# Altium schematic sheet 08 B2B.SchDoc
size A2; VersionControl_RevNumber: DNP; IsUserConfigurable: DNP; OrgAddr3: Sunrise FL 33323; OrgName: Pixels on Target; Page Create Date: March  8, 1995; Page Number: 5; Page Size: A2; Page Count: 14; OrgAddr2: Suite #104; RevCode: A; Doc: SCH30-00070-00; DsnPath: C:\Users\Carter Nichols\Documents\BitBucket boards (Cadence)\30-00070-00_Original\SCH30-00070-00.DSN; SchematicName: SC30-00070-00; PageName: 05-POWER IN; PageSize: A2; TopSchematic: True; Address4: United States
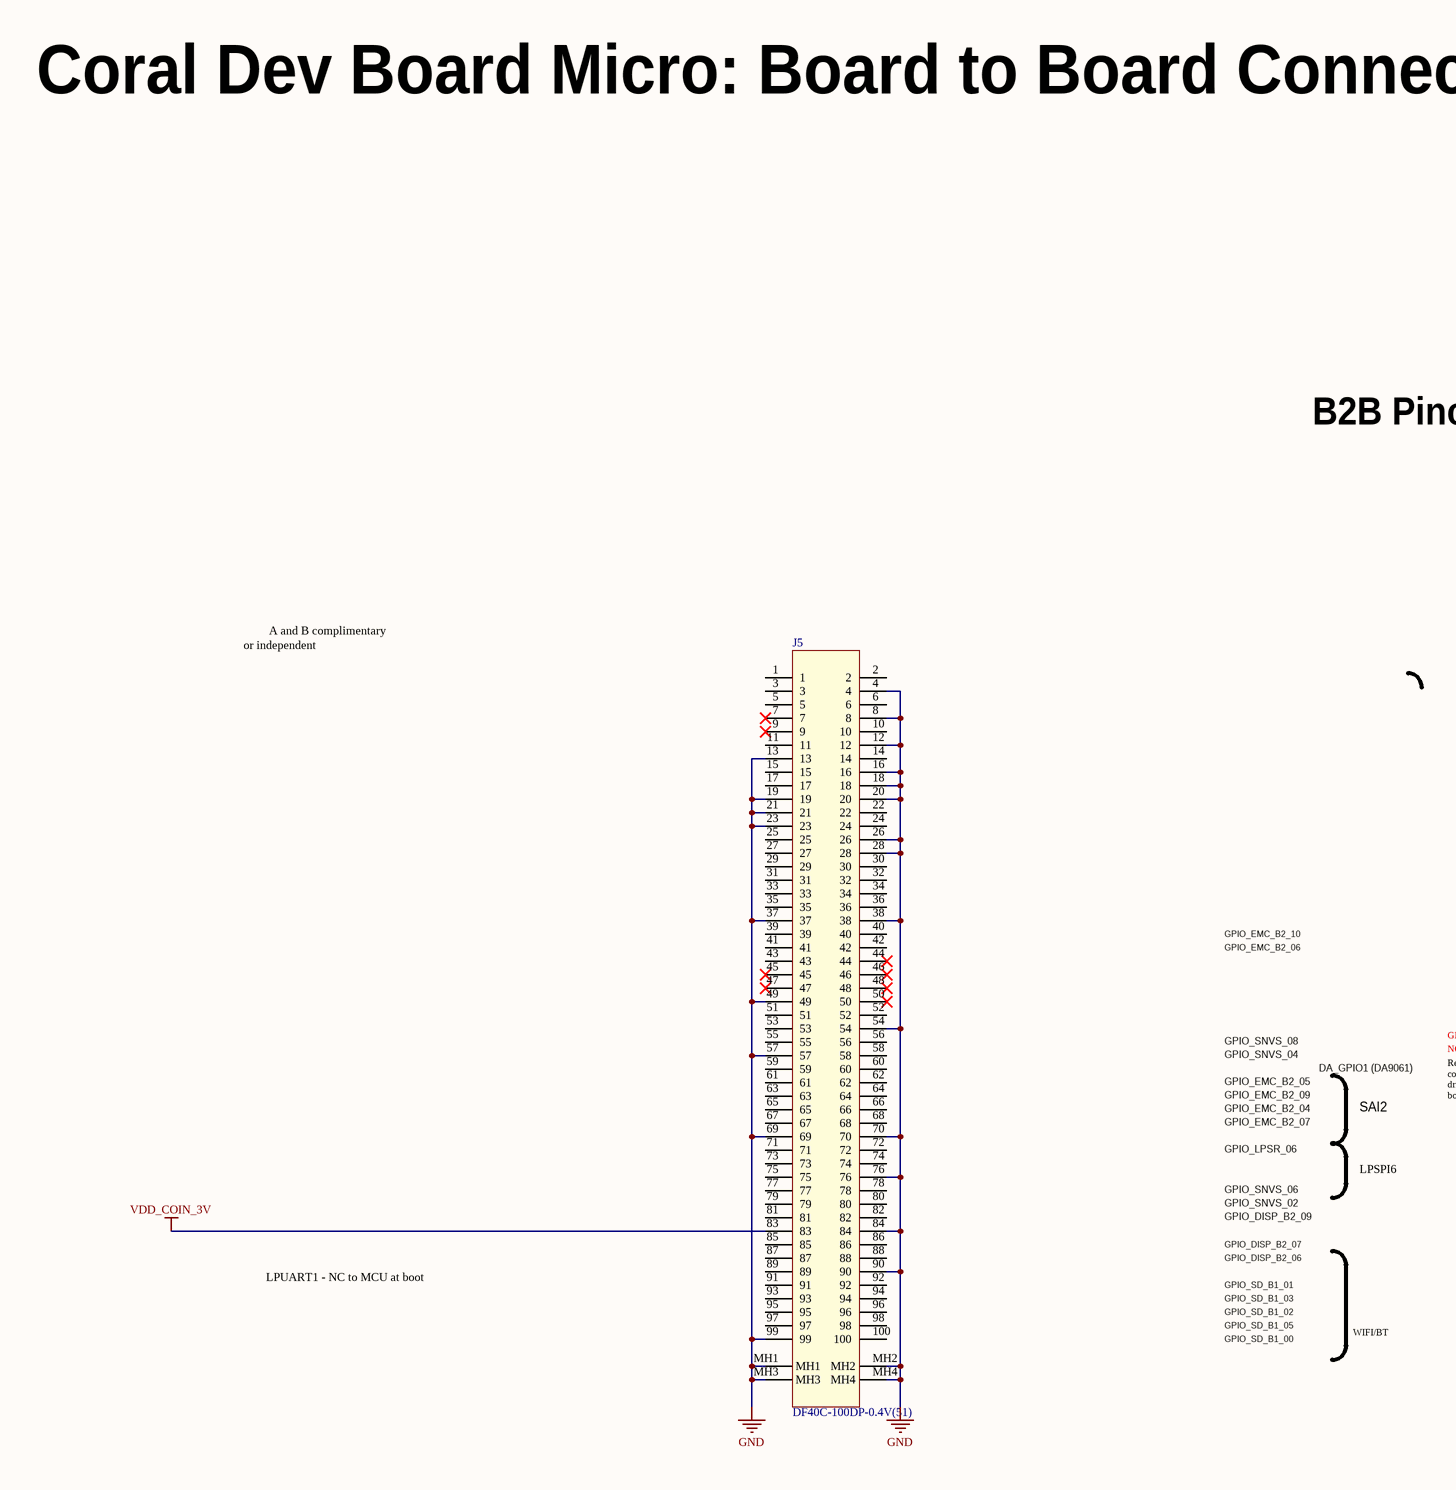
[diagram p0: 08 B2B.SchDoc, left]
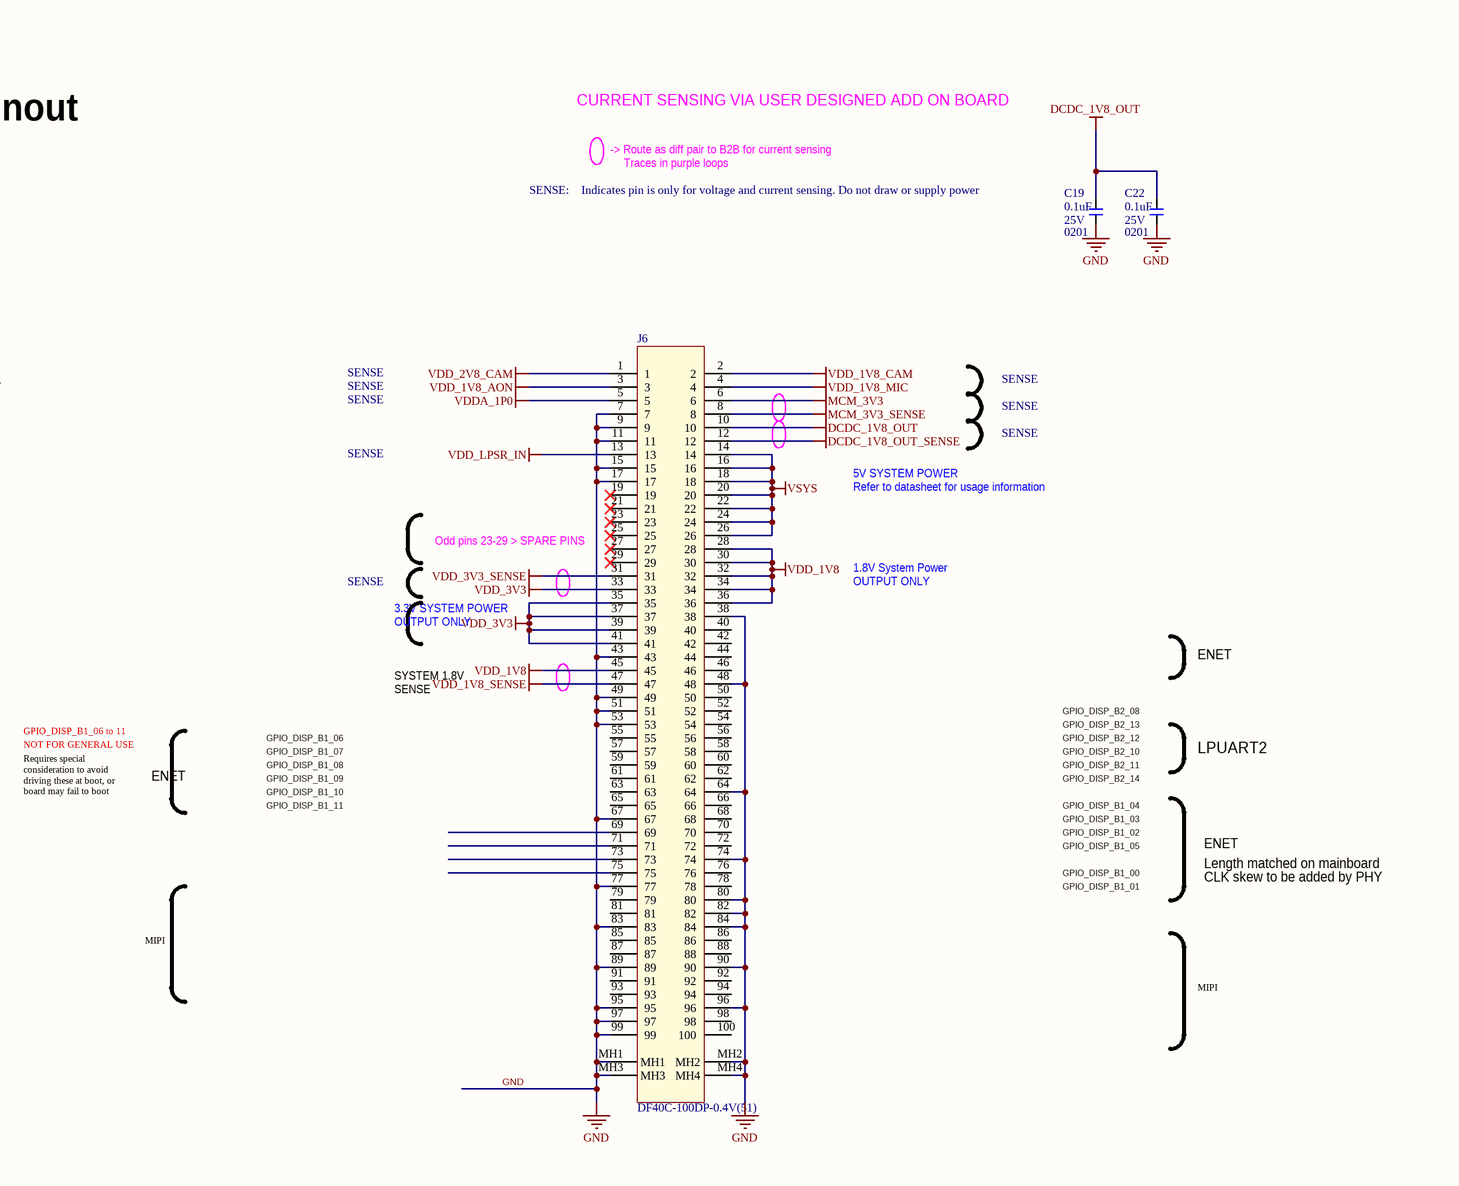
[diagram p1: 08 B2B.SchDoc, right]

## Parts
C19  value 0.1uF  Package: 0201  Voltage: 25V  [C0201Y]  (hidden comment: __Template_Cap)
C22  value 0.1uF  Package: 0201  Voltage: 25V  [C0201Y]  (hidden comment: __Template_Cap)
J5  MFG P/N: DF40C-100DP-0.4V(51)  [HIROSE_DF40C-100DP-0.4V(51)]
J6  MFG P/N: DF40C-100DP-0.4V(51)  [HIROSE_DF40C-100DP-0.4V(51)]

## Nets
DCDC_1V8_OUT: C19.1 C22.1 J6.10
DCDC_1V8_OUT_SENSE: J6.12
GND: C19.2 C22.2 J5.4 J5.8 J5.12 J5.13 J5.16 J5.18 J5.19 J5.20 J5.21 J5.23 J5.26 J5.28 J5.37 J5.38 J5.49 J5.54 J5.57 J5.69 J5.70 J5.76 J5.84 J5.90 J5.99 J5.MH1 J5.MH2 J5.MH3 J5.MH4 J6.7 J6.9 J6.11 J6.15 J6.17 J6.38 J6.43 J6.48 J6.49 J6.51 J6.53 J6.64 J6.67 J6.74 J6.77 J6.80 J6.82 J6.83 J6.84 J6.89 J6.90 J6.95 J6.96 J6.97 J6.99 J6.MH1 J6.MH2 J6.MH3 J6.MH4
MCM_3V3: J6.6
MCM_3V3_SENSE: J6.8
VDD_1V8: J6.28 J6.30 J6.32 J6.34 J6.36 J6.45
VDD_1V8_AON: J6.3
VDD_1V8_CAM: J6.2
VDD_1V8_MIC: J6.4
VDD_1V8_SENSE: J6.47
VDD_2V8_CAM: J6.1
VDD_3V3: J6.33 J6.35 J6.37 J6.39 J6.41
VDD_3V3_SENSE: J6.31
VDD_COIN_3V: J5.83
VDD_LPSR_IN: J6.13
VDDA_1P0: J6.5
VSYS: J6.14 J6.16 J6.18 J6.20 J6.22 J6.24 J6.26

Not connected (* = marked no-connect by the designer): J5 1 2 3 5 6 7* 9* 10 11 14 15 17 22 24 25 27 29 30 31 32 33 34 35 36 39 40 41 42 43 44* 45* 46* 47* 48* 50* 51 52 53 55 56 58 59 60 61 62 63 64 65 66 67 68 71 72 73 74 75 77 78 79 80 81 82 85 86 87 88 89 91 92 93 94 95 96 97 98 100; J6 19* 21* 23* 25* 27* 29* 40 42 44 46 50 52 54 55 56 57 58 59 60 61 62 63 65 66 68 69 70 71 72 73 75 76 78 79 81 85 86 87 88 91 92 93 94 98 100

## Notes on the sheet
- Coral Dev Board Micro: Board to Board Connector
- B2B Pinout
- CURRENT SENSING VIA USER DESIGNED ADD ON BOARD
- -> Route as diff pair to B2B for current sensing
- (near C19) SENSE:    Indicates pin is only for voltage and current sensing. Do not draw or supply power
- Traces in purple loops
- or independent
- A and B complimentary
- SENSE
- 5V SYSTEM POWER
- Refer to datasheet for usage information
- (near J6) Odd pins 23-29 > SPARE PINS
- 3.3V SYSTEM POWER
- OUTPUT ONLY
- 1.8V System Power
- GPIO_EMC_B2_06
- GPIO_EMC_B2_10
- SYSTEM 1.8V
- ENET
- GPIO_SNVS_04
- GPIO_SNVS_08
- NOT FOR GENERAL USE
- GPIO_DISP_B1_06 to 11
- GPIO_DISP_B1_06
- GPIO_DISP_B1_07
- GPIO_DISP_B2_10
- GPIO_DISP_B2_13
- GPIO_DISP_B2_08
- GPIO_DISP_B2_12
- LPUART2
- GPIO_EMC_B2_04
- GPIO_EMC_B2_05
- GPIO_EMC_B2_07
- GPIO_EMC_B2_09
- DA_GPIO1 (DA9061)
- SAI2
- Requires special consideration to avoid driving these at boot, or board may fail to boot
- GPIO_DISP_B1_08
- GPIO_DISP_B1_09
- GPIO_DISP_B1_10
- GPIO_DISP_B1_11
- GPIO_DISP_B2_11
- GPIO_DISP_B1_02
- GPIO_DISP_B1_03
- GPIO_DISP_B1_04
- GPIO_DISP_B2_14
- GPIO_SNVS_06
- GPIO_LPSR_06
- LPSPI6
- GPIO_DISP_B1_00
- GPIO_DISP_B1_01
- GPIO_DISP_B1_05
- Length matched on mainboard
- CLK skew to be added by PHY
- GPIO_SNVS_02
- GPIO_DISP_B2_09
- GPIO_DISP_B2_07
- GPIO_DISP_B2_06
- MIPI
- LPUART1 - NC to MCU at boot
- GPIO_SD_B1_01
- GPIO_SD_B1_02
- GPIO_SD_B1_03
- GPIO_SD_B1_05
- WIFI/BT
- GPIO_SD_B1_00
- Title
- Size:
- Date:
- File:
- A2
- Number:
- Time:
- Revision:
- Sheet
- of

## Library data of the parts
C19 C22 = 386: CAP, CER, X5R, 0.1uF, 25V, 20%, 0201, 0.33mm T; ID: 386; MFG: MURATA; MFG P/N: GRM033R61E104ME14D; XPN: 150-01204-00; Status: Released; Dielectric: X5R; Tolerance: 20%; Height: 0.33mm T; ComponentLink1Description: Datasheet; COMMON: 150-01204-00; LOON: 150-01204-00; Gecko: 150-01204-00
J5 J6 = 897: CONN, HDR, VERT, 2x50, 0.4MM P, 1.14MM H, GOLD, SMD; ID: 897; MFG: Hirose Electric Co Ltd; Connector Type: Plug, Outer Shroud Contacts; Pitch: 0.40mm; Number of Positions: 100; Gender: Male; Status: Released; RoHS Compliant: Yes; Mounting Type: Surface Mount; Orientation: Vertical; Number of Rows: 2; Features: Solder Retention; Supplier 1: Digi-Key; HelpURL: https://www.digikey.com/product-detail/en/hirose-electric-co-ltd/DF40C-100DP-0.4V-51/H11614CT-ND/1969494; ComponentLink1Description: Datasheet; ComponentLink1URL: https://www.hirose.com/product/download/?distributor=digikey&type=2d&lang=en&num=DF40C-100DP-0.4V(51); Supplier Part Number 1: H11614CT-ND